# Altium project foxbms2-master.PrjPcb (part 6 of 8)

## Sheet sbc-base.SchDoc
size A3; DocumentNumber: 44; SheetNumber: 44; SheetTotal: 45; SheetDescription: System basic chip for MCU
Used 2 times, as channels supply/sbcs/sbc-mcu, supply/sbcs/sbc-per. Parts and nets are listed once, with the designators drawn on the sheet.
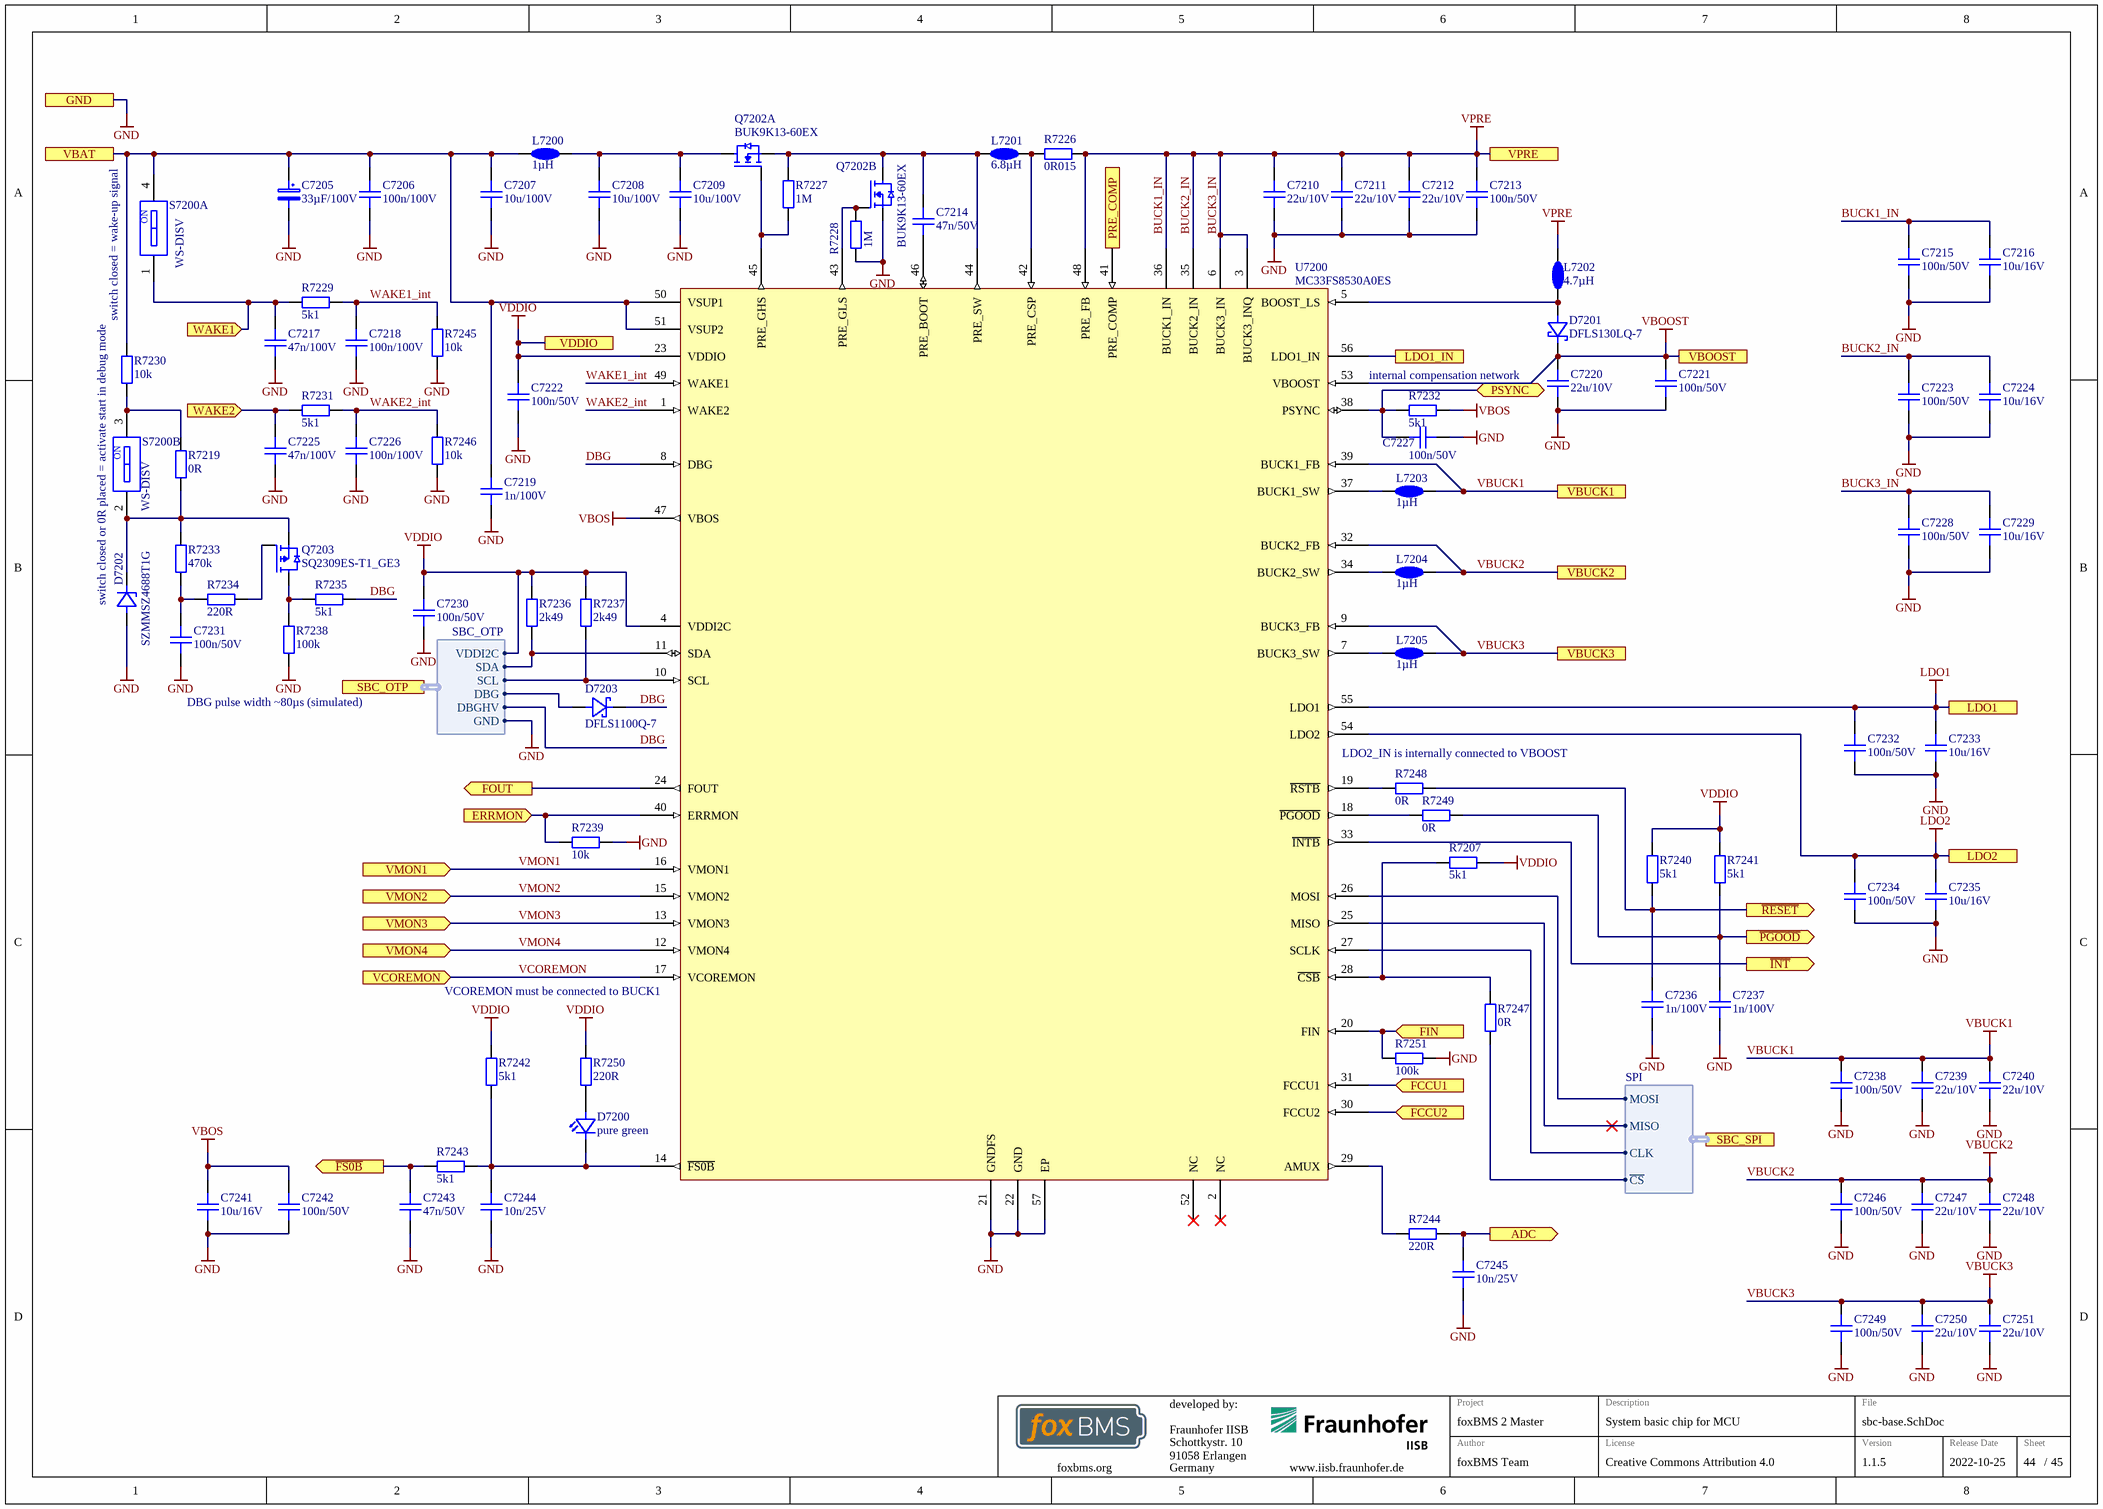
[diagram p41: sbc-base.SchDoc]

### Parts
C7205  33µF/100V  [ELECTROLYTIC_CAP_PANASONIC_G]
C7206  100n/100V  [CAPC1608X08N]
C7207  10u/100V  [CAPC5750X28N]
C7208  10u/100V  [CAPC5750X28N]
C7209  10u/100V  [CAPC5750X28N]
C7210  22u/10V  [CAPC3216X18N]
C7211  22u/10V  [CAPC3216X18N]
C7212  22u/10V  [CAPC3216X18N]
C7213  100n/50V  [CAPC1005X06N]
C7214  47n/50V  [CAPC1005X06N]
C7215  100n/50V  [CAPC1005X06N]
C7216  10u/16V  [CAPC2012X14N]
C7217  47n/100V  [CAPC1608X08N]
C7218  100n/100V  [CAPC1608X08N]
C7219  1n/100V  [CAPC1005X06N]
C7220  22u/10V  [CAPC3216X18N]
C7221  100n/50V  [CAPC1005X06N]
C7222  100n/50V  [CAPC1005X06N]
C7223  100n/50V  [CAPC1005X06N]
C7224  10u/16V  [CAPC2012X14N]
C7225  47n/100V  [CAPC1608X08N]
C7226  100n/100V  [CAPC1608X08N]
C7227  100n/50V  [CAPC1005X06N]
C7228  100n/50V  [CAPC1005X06N]
C7229  10u/16V  [CAPC2012X14N]
C7230  100n/50V  [CAPC1005X06N]
C7231  100n/50V  [CAPC1005X06N]
C7232  100n/50V  [CAPC1005X06N]
C7233  10u/16V  [CAPC2012X14N]
C7234  100n/50V  [CAPC1005X06N]
C7235  10u/16V  [CAPC2012X14N]
C7236  1n/100V  [CAPC1005X06N]
C7237  1n/100V  [CAPC1005X06N]
C7238  100n/50V  [CAPC1005X06N]
C7239  22u/10V  [CAPC3216X18N]
C7240  22u/10V  [CAPC3216X18N]
C7241  10u/16V  [CAPC2012X14N]
C7242  100n/50V  [CAPC1005X06N]
C7243  47n/50V  [CAPC1005X06N]
C7244  10n/25V  [CAPC1005X06N]
C7245  10n/25V  [CAPC1005X06N]
C7246  100n/50V  [CAPC1005X06N]
C7247  22u/10V  [CAPC3216X18N]
C7248  22u/10V  [CAPC3216X18N]
C7249  100n/50V  [CAPC1005X06N]
C7250  22u/10V  [CAPC3216X18N]
C7251  22u/10V  [CAPC3216X18N]
D7200  pure green  [LEDC1608X07N]
D7201  DFLS130LQ-7  [PowerDI123]
D7202  SZMMSZ4688T1G  [SOD-123_CASE-425-04-ISSUE-G]
D7203  DFLS1100Q-7  [PowerDI123]
L7200  1µH  [ASPIAIG-S4035]
L7201  6.8µH  [PA4342.XXXNLT_Footprint_2]
L7202  4.7µH  [ASPIAIG-S4035]
L7203  1µH  [TDK_TFM252012]
L7204  1µH  [TDK_TFM252012]
L7205  1µH  [TDK_TFM252012]
Q7202  BUK9K13-60EX  [NXP-SOT1205_N]  (parts A,B of 2)
Q7203  SQ2309ES-T1_GE3  [SOT95P237X110-3N]
R7207  5k1  [RESC1005X04N]
R7219  0R  [RESC1005X04N]
R7226  0R015  [PANASONIC_ERJ-B1]
R7227  1M  [RESC1005X04N]
R7228  1M  [RESC1005X04N]
R7229  5k1  [RESC1005X04N]
R7230  10k  [RESC1005X04N]
R7231  5k1  [RESC1005X04N]
R7232  5k1  [RESC1005X04N]
R7233  470k  [RESC1005X04N]
R7234  220R  [RESC1005X04N]
R7235  5k1  [RESC1005X04N]
R7236  2k49  [RESC1005X04N]
R7237  2k49  [RESC1005X04N]
R7238  100k  [RESC1005X04N]
R7239  10k  [RESC1005X04N]
R7240  5k1  [RESC1005X04N]
R7241  5k1  [RESC1005X04N]
R7242  5k1  [RESC1005X04N]
R7243  5k1  [RESC1005X04N]
R7244  220R  [RESC1005X04N]
R7245  10k  [RESC1005X04N]
R7246  10k  [RESC1005X04N]
R7247  0R  [RESC1005X04N]
R7248  0R  [RESC1005X04N]
R7249  0R  [RESC1005X04N]
R7250  220R  [RESC1005X04N]
R7251  100k  [RESC1005X04N]
S7200  WS-DISV  [WE_416131160802]  (parts A,B of 2)
U7200  MC33FS8530A0ES  [MC33FS8530A0ES]

### Ports
ADC (out), ERRMON (in), FCCU1 (in), FCCU2 (in), FIN (in), FOUT (out), GND, LDO1, LDO1_IN, LDO2, PRE_COMP (in), PSYNC (bidir), SBC_OTP (harness SBC_OTP), SBC_SPI (harness SPI), VBAT, VBOOST, VBUCK1, VBUCK2, VBUCK3, VCOREMON (in), VDDIO, VMON1 (in), VMON2 (in), VMON3 (in), VMON4 (in), VPRE, WAKE1 (in), WAKE2 (in), ~{FS0B} (out), ~{INT} (out), ~{PGOOD} (out), ~{RESET} (out)

### Harnesses
SBC_OTP: VDDI2C, SDA, SCL, GND, DBG, DBGHV
SPI: CLK, MOSI, MISO, ~{CS}

### Nets
GND: C7205.2 C7206.1 C7207.1 C7208.1 C7209.1 C7210.1 C7211.1 C7212.1 C7213.1 C7215.1 C7216.1 C7217.1 C7218.1 C7219.1 C7220.1 C7221.1 C7222.1 C7223.1 C7224.1 C7225.1 C7226.1 C7227.1 C7228.1 C7229.1 C7230.1 C7231.1 C7232.1 C7233.1 C7234.1 C7235.1 C7236.1 C7237.1 C7238.1 C7239.1 C7240.1 C7241.1 C7242.1 C7243.1 C7244.1 C7245.1 C7246.1 C7247.1 C7248.1 C7249.1 C7250.1 C7251.1 D7202.2(A) Q7202.3(S) R7228.1 R7238.1 R7239.1 R7245.2 R7246.2 R7251.2 U7200.21(GNDFS) U7200.22(GND) U7200.57(EP) ; port GND, port SBC_OTP.GND
LDO1: C7232.2 C7233.2 U7200.55(LDO1) ; port LDO1
LDO2: C7234.2 C7235.2 U7200.54(LDO2) ; port LDO2
VBOOST: C7220.2 C7221.2 D7201.1(K) U7200.53(VBOOST) ; port VBOOST
VBOS: C7241.2 C7242.2 R7232.2 U7200.47(VBOS)
VBUCK1: C7238.2 C7239.2 C7240.2 L7203.2 U7200.39(BUCK1_FB) ; port VBUCK1
VBUCK2: C7246.2 C7247.2 C7248.2 L7204.2 U7200.32(BUCK2_FB) ; port VBUCK2
VBUCK3: C7249.2 C7250.2 C7251.2 L7205.2 U7200.9(BUCK3_FB) ; port VBUCK3
VDDIO: C7222.2 C7230.2 R7207.1 R7236.2 R7237.2 R7240.2 R7241.2 R7242.2 R7250.2 U7200.4(VDDI2C) U7200.23(VDDIO) ; port VDDIO, port SBC_OTP.VDDI2C
VPRE: C7210.2 C7211.2 C7212.2 C7213.2 C7215.2 C7216.2 C7223.2 C7224.2 C7228.2 C7229.2 L7202.2 R7226.2 U7200.3(BUCK3_INQ) U7200.6(BUCK3_IN) U7200.35(BUCK2_IN) U7200.36(BUCK1_IN) U7200.48(PRE_FB) ; port VPRE  [also labelled BUCK1_IN, BUCK2_IN, BUCK3_IN]
~{FS0B}: C7243.2 R7243.2 ; port ~{FS0B}
~{INT}: U7200.33(~{INTB}) ; port ~{INT}
~{PGOOD}: C7237.2 R7241.1 R7249.2 ; port ~{PGOOD}
~{RESET}: C7236.2 R7240.1 R7248.1 ; port ~{RESET}
ADC: C7245.2 R7244.2 ; port ADC
DBG: D7203.1(K) R7235.1 U7200.8(DBG) ; port SBC_OTP.DBGHV
ERRMON: R7239.2 U7200.40(ERRMON) ; port ERRMON
FCCU1: U7200.31(FCCU1) ; port FCCU1
FCCU2: U7200.30(FCCU2) ; port FCCU2
FIN: R7251.1 U7200.20(FIN) ; port FIN
FOUT: U7200.24(FOUT) ; port FOUT
LDO1_IN: U7200.56(LDO1_IN) ; port LDO1_IN
PRE_COMP: U7200.41(PRE_COMP) ; port PRE_COMP
PSYNC: C7227.2 R7232.1 U7200.38(PSYNC) ; port PSYNC
VBAT: C7205.1 C7206.2 C7207.2 C7219.2 L7200.1 R7230.2 S7200.4 U7200.50(VSUP1) U7200.51(VSUP2) ; port VBAT
VCOREMON: U7200.17(VCOREMON) ; port VCOREMON
VMON1: U7200.16(VMON1) ; port VMON1
VMON2: U7200.15(VMON2) ; port VMON2
VMON3: U7200.13(VMON3) ; port VMON3
VMON4: U7200.12(VMON4) ; port VMON4
WAKE1: C7217.2 R7229.2 S7200.1 ; port WAKE1
WAKE1_int: C7218.2 R7229.1 R7245.1 U7200.49(WAKE1)  [project net WAKE1_int_44]
WAKE2: C7225.2 R7231.2 ; port WAKE2
WAKE2_int: C7226.2 R7231.1 R7246.1 U7200.1(WAKE2)  [project net WAKE2_int_44]
NetC7208_2: C7208.2 C7209.2 L7200.2 Q7202.7(D)
NetC7214_1: C7214.1 U7200.46(PRE_BOOT)
NetC7214_2: C7214.2 L7201.1 Q7202.1(S) Q7202.5(D) R7227.2 U7200.44(PRE_SW)
NetC7231_2: C7231.2 R7233.1 R7234.1
NetC7244_2: C7244.2 D7200.1(C) R7242.1 R7243.1 U7200.14(~{FS0B})
NetD7200_2: D7200.2(A) R7250.1
NetD7201_2: D7201.2(A) L7202.1 U7200.5(BOOST_LS)
NetD7202_1: D7202.1(K) Q7203.S R7219.1 R7233.2 S7200.2
NetD7203_2: D7203.2(A) ; port SBC_OTP.DBG
NetL7201_2: L7201.2 R7226.1 U7200.42(PRE_CSP)
NetL7203_1: L7203.1 U7200.37(BUCK1_SW)
NetL7204_1: L7204.1 U7200.34(BUCK2_SW)
NetL7205_1: L7205.1 U7200.7(BUCK3_SW)
NetQ7202_2: Q7202.2(G) R7227.1 U7200.45(PRE_GHS)
NetQ7202_4: Q7202.4(G) R7228.2 U7200.43(PRE_GLS)
NetQ7203_D: Q7203.D R7235.2 R7238.2
NetQ7203_G: Q7203.G R7234.2
NetR7207_2: R7207.2 R7247.2 U7200.28(~{CSB})
NetR7219_2: R7219.2 R7230.1 S7200.3
NetR7236_1: R7236.1 U7200.11(SDA) ; port SBC_OTP.SDA
NetR7237_1: R7237.1 U7200.10(SCL) ; port SBC_OTP.SCL
NetR7244_1: R7244.1 U7200.29(AMUX)
NetR7247_1: R7247.1 ; port SBC_SPI.~{CS}
NetR7248_2: R7248.2 U7200.19(~{RSTB})
NetR7249_1: R7249.1 U7200.18(~{PGOOD})
NetU7200_25: U7200.25(MISO) ; port SBC_SPI.MISO
NetU7200_26: U7200.26(MOSI) ; port SBC_SPI.MOSI
NetU7200_27: U7200.27(SCLK) ; port SBC_SPI.CLK

Not connected (* = marked no-connect by the designer): U7200 2(NC)* 52(NC)*

### Channels
supply/sbcs/sbc-mcu: designators end in _1; ports ADC=SUPPLY_IO.SBC_MCU_ADC ERRMON=NetR7239_1_2 FCCU1=MCU_RST~{.}ERROR FCCU2=MCU_GIOX.T7 FIN=MCU_CLK.2.22MHz FOUT=NetR7251_2_1 GND=GND LDO1=MCU_1.2V_LDO LDO1_IN=MCU_3.3V LDO2=MCU_5.0V_LDO PRE_COMP=NetC7201_1 PSYNC=NetC7227_1_2 VBAT=VSUP_30 VBOOST=MCU_5.74V VBUCK1=MCU_1.2V VBUCK2=MCU_1.1V VBUCK3=MCU_2.5V VCOREMON=VCOREMON VDDIO=MCU_3.3V VMON1=VMON1 VMON2=VMON2 VMON3=VMON3 VMON4=VMON4 VPRE=MCU_3.3V WAKE1=COM_IO.INH WAKE2=PER_IO~{.}RTC_INTA_HV ~{FS0B}=EXT_CON.SBC_MCU_FS0B ~{INT}=MCU_GIOA.0 ~{PGOOD}=EXT_CON~{.}SBC_MCU_PGOOD ~{RESET}=EXT_CON~{.}SBC_MCU_RESET
supply/sbcs/sbc-per: designators end in _2; ports ADC=SUPPLY_IO.SBC_PER_ADC ERRMON=NetR7239_2_2 FCCU1=NetR7211_2 FCCU2=MCU_GIOX.T8 FIN=NetR7251_2_1 FOUT=NetU7200_2_24 GND=GND LDO1=PER_3.3V_LDO LDO1_IN=PER_5.0V LDO2=PER_5.0V_LDO PRE_COMP=NetC7203_1 PSYNC=NetC7227_2_2 VBAT=VSUP_30 VBOOST=PER_5.74V VBUCK1=PER_1.2V_0 VBUCK2=PER_1.2V_1 VBUCK3=PER_3.3V VCOREMON=VCOREMON VDDIO=PER_3.3V VMON1=VMON1 VMON2=VMON2 VMON3=VMON3 VMON4=VMON4 VPRE=PER_5.0V WAKE1=NetC7217_2_2 WAKE2=WAKE2 ~{FS0B}=EXT_CON.SBC_PER_FS0B ~{INT}=MCU_GIOA.1 ~{PGOOD}=EXT_CON~{.}SBC_PER_PGOOD ~{RESET}=EXT_CON~{.}SBC_PER_RESET

### Notes on the sheet
- (near R7230) switch closed = wake-up signal
- (near C7220) internal compensation network
- switch closed or 0R placed = activate start in debug mode
- DBG pulse width ~80µs (simulated)
- (near U7200) LDO2_IN is internally connected to VBOOST
- (near U7200) VCOREMON must be connected to BUCK1
- Fraunhofer IISB
- Schottkystr. 10
- developed by:
- 91058 Erlangen
- Germany
- Author
- Project
- License
- Description
- File
- Version
- Release Date
- Sheet
- foxbms.org <https://foxbms.org>
- www.iisb.fraunhofer.de <https://www.iisb.fraunhofer.de/>
- foxBMS Team
- /
- (in symbol WE_416131160802, part A) ON
- (in symbol WE_416131160802, part B) ON

### Library data of the parts
C7205 = EEE-TG2A330P: SMD Electrolytic Capacitor; Capacitance: 33µF; Rated Voltage: 100V; Tolerance: +-20%; Heigth: 10.5mm; Automotive Qualified: True; Part Number: EEE-TG2A330P; Operating Temperature: -40°C to 125°C; Diameter: 10mm; ComponentLink1Description: Datasheet; ComponentLink1URL: https://industrial.panasonic.com/cdbs/www-data/pdf/RDE0000/ABA0000C1187.pdf; Supplier 1: Digikey; Supplier Part Number 1: PCE4126CT-ND
C7206 C7218 C7226 = gen_C_ceramic_100n_100V_X7R_0603: MLCC; Capacitance: 100n; Rated Voltage: 100V; Dielectric: X7R; Case EIA: 0603; Case Metric: 1608; Automotive Qualified: True; PnP Package: 0603C; Part Number: gen_C_ceramic_100n_100V_X7R_0603; Supplier 1: Digikey; Supplier Part Number 1: 490-13420-1-ND; Supplier 2: Mouser; Supplier Part Number 2: 81-GCJ188R72A104KA1D
C7207-C7209 = gen_C_ceramic_10u_100V_X7S_2220: as C7105-C7108 on sheet buck-boost-converter; Part Number: gen_C_ceramic_10u_100V_X7S_2220; Supplier 1: Digikey; Supplier Part Number 1: 445-13152-1-ND; ECCN: EAR99
C7210-C7212 C7220 C7239 C7240 C7247 C7248 C7250 C7251 = gen_C_ceramic_22u_10V_X7R_1206: MLCC; Capacitance: 22u; Rated Voltage: 10V; Dielectric: X7R; Case EIA: 1206; Case Metric: 3216; Automotive Qualified: True; Part Number: gen_C_ceramic_22u_10V_X7R_1206; Supplier 1: Digikey; Supplier Part Number 1: 587-4243-1-ND
C7213 C7215 C7221-C7223 C7227 C7228 C7230-C7232 C7234 C7238 C7242 C7246 C7249 = gen_C_ceramic_100n_50V_X7R_0402: MLCC; Capacitance: 100n; Rated Voltage: 50V; Dielectric: X7R; Case EIA: 0402; Case Metric: 1005; PnP Package: 0402C; PnP Value: 100nF/50V/X7R; PnP equipped: x; Automotive Qualified: True; AEC-Q Norm: AEC-Q200; Part Number: gen_C_ceramic_100n_50V_X7R_0402; Supplier 1: Farnell; Supplier Part Number 1: 2210822; ECCN: EAR99
C7214 C7243 = gen_C_ceramic_47n_50V_X7R_0402: MLCC; Capacitance: 47n; Rated Voltage: 50V; Dielectric: X7R; Case EIA: 0402; Case Metric: 1005; Automotive Qualified: True; PnP Package: 0402C; Part Number: gen_C_ceramic_47n_50V_X7R_0402; Supplier 1: Farnell; Supplier Part Number 1: 2210827
C7216 C7224 C7229 C7233 C7235 C7241 = gen_C_ceramic_10u_16V_X7R_0805: MLCC; Capacitance: 10u; Rated Voltage: 16V; Dielectric: X7S; Case EIA: 0805; Case Metric: 2012; Automotive Qualified: True; AEC-Q Grade: Grade 1; AEC-Q Norm: AEC-Q200; Part Number: gen_C_ceramic_10u_16V_X7R_0805; ECCN: EAR99; Supplier 1: Digikey; Supplier Part Number 1: 445-16110-1-ND
C7217 C7225 = gen_C_ceramic_47n_100V_X7R_0603: MLCC; Capacitance: 47n; Rated Voltage: 100V; Dielectric: X7R; Case EIA: 0603; Case Metric: 1608; Automotive Qualified: True; PnP Package: 0603C; Part Number: gen_C_ceramic_47n_100V_X7R_0603; Supplier 1: Farnell; Supplier Part Number 1: 2478249; Supplier 2: Farnell; Supplier Part Number 2: 2708699; Supplier 3: Farnell; Supplier Part Number 3: 2905110
C7219 C7236 C7237 = gen_C_ceramic_1n_100V_X7R_0402: MLCC; Capacitance: 1n; Rated Voltage: 100V; Dielectric: X7R; Case EIA: 0402; Case Metric: 1005; Automotive Qualified: True; PnP Package: 0402C; Part Number: gen_C_ceramic_1n_100V_X7R_0402; Supplier 1: Digikey; Supplier Part Number 1: 490-4764-1-ND
C7244 C7245 = gen_C_ceramic_10n_25V_X7R_0402: MLCC; Capacitance: 10n; Rated Voltage: 25V; Dielectric: X7R; Case EIA: 0402; Case Metric: 1005; PnP Package: 0402C; PnP Value: 10nF/25V/X7R; PnP equipped: x; Automotive Qualified: True; Part Number: gen_C_ceramic_10n_25V_X7R_0402; Supplier 1: Farnell; Supplier Part Number 1: 2210793
D7200 = LED_0603_pure_green_AECQ: as D7000-D7003 on sheet supply; Part Number: LED_0603_pure_green_AECQ; Color: pure green; Operating Temperature: -40°C - 100°C; ComponentLink1Description: Datasheet; ComponentLink1URL: http://www.farnell.com/datasheets/2049164.pdf; Supplier 1: Farnell; Supplier Part Number 1: 1328306; Supplier 2: Digikey; Supplier Part Number 2: 751-1176-1-ND; PnP Package: LED_0603
D7201 = DFLS130LQ-7: Schottky Diode; Manufacturer: Diodes Inc.; Breakdown Voltage: 30V; Continuous Forward Current: 1A; Automotive Qualified: True; Part Number: DFLS130LQ-7; Part Name: DFLS130LQ-7; Operating Temperature: −40°C - +125°C; ComponentLink1Description: Datasheet; ComponentLink1URL: https://www.diodes.com/assets/Datasheets/DFLS130LQ.pdf; Supplier 1: Digikey; Supplier Part Number 1: DFLS130LQ-7DICT-ND
D7202 = SZMMSZ4688T1G: Zener Diode; Manufacturer: ON Semiconductor; Breakdown Voltage: 4.7V; PnP Package: SOD123; Automotive Qualified: True; Part Number: SZMMSZ4688T1G; Part Name: SZMMSZ4688T1G; Operating Temperature: -55°C - +150°C; ComponentLink1Description: Datasheet; ComponentLink1URL: https://www.onsemi.com/pub/Collateral/MMSZ4678T1-D.PDF; Supplier 1: Digikey; Supplier Part Number 1: SZMMSZ4688T1GOSCT-ND; Supplier 2: Farnell; Supplier Part Number 2: 2774579; Supplier 3: Mouser; Supplier Part Number 3: 863-SZMMSZ4688T1G
D7203 = DFLS1100Q-7: Schottky Diode; Manufacturer: Diodes Inc.; Breakdown Voltage: 100V; Continuous Forward Current: 1A; Automotive Qualified: True; Part Number: DFLS1100Q-7; Part Name: DFLS1100Q-7; Operating Temperature: −55°C - +175°C; ComponentLink1Description: Datasheet; ComponentLink1URL: https://www.diodes.com/assets/Datasheets/ds30497.pdf; Supplier 1: Mouser; Supplier Part Number 1: 621-DFLS1-100Q-7; Supplier 2: Digikey; Supplier Part Number 2: DFLS1100Q-7DICT-ND; Supplier 3: Farnell; Supplier Part Number 3: 3127293; PnP Package: POWERDI123
L7200 = ASPIAIG-S4035-1R0M-T: Power Inductor; Manufacturer: Abracon LLC; Rated Current: 4.5A; Saturation Current: 6.9A; Automotive Qualified: True; Part Number: ASPIAIG-S4035-1R0M-T; Operating Temperature: –40°C - +125°C; ComponentLink1Description: Datasheet; ComponentLink1URL: https://abracon.com/Magnetics/power/ASPIAIG-S4035.pdf; Inductance: 1µH; Supplier 1: Digikey; Supplier Part Number 1: 535-14223-1-ND; Supplier 2: Farnell; Supplier Part Number 2: 2848347
L7201 = PA4342.682NLT: Power Inductor; Manufacturer: Pulse; Rated Current: 8.5A; Saturation Current: 13.5A; Automotive Qualified: True; Part Number: PA4342.682NLT; Operating Temperature: -40°C - +125°C; ComponentLink1Description: Datasheet; ComponentLink1URL: https://www.mouser.de/datasheet/2/336/P769-1526786.pdf; Inductance: 6.8µH; Supplier 1: Digikey; Supplier Part Number 1: 553-3442-1-ND; Supplier 2: Mouser; Supplier Part Number 2: 673-PA4342.682NLT
L7202 = ASPIAIG-S4035-4R7M-T: Power Inductor; Manufacturer: Abracon LLC; Rated Current: 2.45A; Saturation Current: 3.2A; Automotive Qualified: True; Part Number: ASPIAIG-S4035-4R7M-T; Operating Temperature: –40°C - +125°C; ComponentLink1Description: Datasheet; ComponentLink1URL: https://abracon.com/Magnetics/power/ASPIAIG-S4035.pdf; Inductance: 4.7µH; Supplier 1: Digikey; Supplier Part Number 1: 535-14227-1-ND
L7203-L7205 = TFM252012ALMA1R0MTAA: Power Inductor; Manufacturer: TDK; Rated Current: 3.7A; Saturation Current: 4.2A; Automotive Qualified: True; Part Number: TFM252012ALMA1R0MTAA; Operating Temperature: –55°C - +150°C; ComponentLink1Description: Datasheet; ComponentLink1URL: https://product.tdk.com/info/en/catalog/datasheets/inductor_automotive_power_tfm252012alma_en.pdf; Inductance: 1µH; Supplier 1: Digikey; Supplier Part Number 1: 445-175183-1-ND
Q7202 = BUK9K13-60EX: Dual N-channel 60 V, 12.5 mΩ logic level MOSFET; Manufacturer: Nexperia; Maximum Drain-Source Voltage: 60V; Maximum Continous Drain Current (25°C): 40A; R_DS(on): 12.5m; Total Gate Charge: 7.9nC; Automotive Qualified: True; AEC-Q Norm: AEC-Q101; AEC-Q Grade: Grade 0; Part Number: BUK9K13-60EX; Part Name: BUK9K13-60EX; Operating Temperature: -55°C - +170°C; ComponentLink1Description: Datasheet; ComponentLink1URL: https://4donline.ihs.com/images/VipMasterIC/IC/NEXP/NEXP-S-A0003105620/NEXP-S-A0003105797-1.pdf?hkey=6D3A4C79FDBF58556ACFDE234799DDF0; Supplier 1: Digikey; Supplier Part Number 1: 1727-2467-1-ND; Supplier 2: Mouser; Supplier Part Number 2: 771-BUK9K13-60EX; Supplier 3: Farnell; Supplier Part Number 3: 3439704; ECCN: EAR99
Q7203 = SQ2309ES-T1_GE3: MOSFET-Transistor, p-channel, -1.7 A, -60 V; Manufacturer: Vishay; Maximum Drain-Source Voltage: 60V; Maximum Continous Drain Current (25°C): 1.7A; R_DS(on): 336m; Total Gate Charge: 8.5nC; Automotive Qualified: True; Part Number: SQ2309ES-T1_GE3; Part Name: PMOS; Operating Temperature: -55°C - +175°C; ComponentLink1Description: Datasheet; ComponentLink1URL: http://www.vishay.com/docs/67024/sq2309es.pdf; Supplier 1: Digikey; Supplier Part Number 1: SQ2309ES-T1_GE3CT-ND; Supplier 2: Farnell; Supplier Part Number 2: 2617108; Supplier 3: Mouser; Supplier Part Number 3: 781-SQ2309ES-T1_GE3
R7207 R7229 R7231 R7232 R7235 R7240-R7243 = gen_R_5k1_0402: SMD Resistor 5k1 0402; Tolerance: 1%; Power: 0.063W; Case EIA: 0402; Case Metric: 1005; Maximum Working Voltage: 50V; PnP Package: 0402R; PnP equipped: x; Automotive Qualified: True; AEC-Q Grade: Grade 0; AEC-Q Norm: AEC-Q200; Part Number: gen_R_5k1_0402; Operating Temperature: -55°C - +155°C; Resistance: 5k1; Series: E24; PnP Value: 5k1; ECCN: EAR99; Supplier 1: Farnell; Supplier Part Number 1: 2302709
R7219 R7247-R7249 = gen_R_0R_0402: SMD Resistor 0R 0402; Power: 0.063W; Case EIA: 0402; Case Metric: 1005; Maximum Working Voltage: 50V; PnP Package: 0402R; Automotive Qualified: True; AEC-Q Norm: AEC-Q200; PnP equipped: x; Part Number: gen_R_0R_0402; Operating Temperature: -55°C - +155°C; Resistance: 0R; Series: Jumper; PnP Value: 0R; Supplier 1: Farnell; Supplier Part Number 1: 1469661; Supplier 2: Farnell; Supplier Part Number 2: 2059190; ECCN: EAR99
R7226 = ERJ-B1CFR015U: SMD Shunt Resistor 0R015; Tolerance: 1%; Power: 2W; Case EIA: ERJ-B1; Maximum Working Voltage: 200V; Automotive Qualified: True; Part Number: ERJ-B1CFR015U; Operating Temperature: -55°C - +155°C; Resistance: 0R015; Supplier 1: Farnell; Supplier Part Number 1: 2294050; Supplier 2: Mouser; Supplier Part Number 2: 667-ERJ-B1CFR015U
R7227 R7228 = gen_R_1M_0402: SMD Resistor 1M 0402; Tolerance: 1%; Power: 0.063W; Case EIA: 0402; Case Metric: 1005; Maximum Working Voltage: 50V; PnP Package: 0402R; Automotive Qualified: True; AEC-Q Grade: Grade 0; AEC-Q Norm: AEC-Q200; Part Number: gen_R_1M_0402; Operating Temperature: -55°C - +155°C; Resistance: 1M; Series: E24, E96; PnP Value: 1M; ECCN: EAR99; Supplier 1: Digikey; Supplier Part Number 1: A129663CT-ND
R7230 R7245 R7246 = gen_R_10k_0402: SMD Resistor 10k 0402; Tolerance: 1%; Power: 0.063W; Case EIA: 0402; Case Metric: 1005; Maximum Working Voltage: 50V; PnP Package: 0402R; PnP equipped: x; Automotive Qualified: True; AEC-Q Norm: AEC-Q200; Part Number: gen_R_10k_0402; Operating Temperature: -55°C - +155°C; Resistance: 10k; Series: E24, E96; PnP Value: 10k; Supplier 1: Farnell; Supplier Part Number 1: 2059239; ECCN: EAR99
R7233 = gen_R_470k_0402: SMD Resistor 470k 0402; Tolerance: 1%; Power: 0.063W; Case EIA: 0402; Case Metric: 1005; Maximum Working Voltage: 50V; PnP Package: 0402R; Automotive Qualified: True; Part Number: gen_R_470k_0402; Operating Temperature: -55°C - +155°C; Resistance: 470k; Series: E24; PnP Value: 470k; Supplier 1: Farnell; Supplier Part Number 1: 2302916
R7234 R7244 = gen_R_220R_0402: SMD Resistor 220R 0402; Tolerance: 1%; Power: 0.063W; Case EIA: 0402; Case Metric: 1005; Maximum Working Voltage: 50V; PnP Package: 0402R; Automotive Qualified: True; AEC-Q Grade: Grade 0; AEC-Q Norm: AEC-Q200; Part Number: gen_R_220R_0402; Operating Temperature: -55°C - +155°C; Resistance: 220R; Series: E24; PnP Value: 220R; ECCN: EAR99; Supplier 1: Digikey; Supplier Part Number 1: A129619CT-ND
R7236 R7237 = gen_R_2k49_0402: SMD Resistor 2k49 0402; Tolerance: 1%; Power: 0.063W; Case EIA: 0402; Case Metric: 1005; Maximum Working Voltage: 50V; PnP Package: 0402R; Automotive Qualified: True; Part Number: gen_R_2k49_0402; Operating Temperature: -55°C - +155°C; Resistance: 2k49; Series: E96; PnP Value: 2k49; Supplier 1: Farnell; Supplier Part Number 1: 2059135
R7238 R7251 = gen_R_100k_0402: SMD Resistor 100k 0402; Tolerance: 1%; Power: 0.063W; Case EIA: 0402; Case Metric: 1005; Maximum Working Voltage: 50V; PnP Package: 0402R; PnP equipped: x; Automotive Qualified: True; Part Number: gen_R_100k_0402; Operating Temperature: -55°C - +155°C; Resistance: 100k; Series: E24, E96; PnP Value: 100k; Supplier 1: Farnell; Supplier Part Number 1: 2302839
R7239 = gen_R_10k_0402: SMD Resistor 10k 0402; Tolerance: 1%; Power: 0.063W; Case EIA: 0402; Case Metric: 1005; Maximum Working Voltage: 50V; PnP Package: 0402R; Automotive Qualified: True; PnP equipped: x; AEC-Q Norm: AEC-Q200; Part Number: gen_R_10k_0402; Operating Temperature: -55°C - +155°C; Resistance: 10k; Series: E24, E96; PnP Value: 10k; Supplier 1: Farnell; Supplier Part Number 1: 2059239; ECCN: EAR99
R7250 = gen_R_220R_0402: SMD Resistor 220R 0402; Tolerance: 1%; Power: 0.063W; Case EIA: 0402; Case Metric: 1005; Maximum Working Voltage: 50V; PnP Package: 0402R; Automotive Qualified: True; AEC-Q Norm: AEC-Q200; AEC-Q Grade: Grade 0; Part Number: gen_R_220R_0402; Operating Temperature: -55°C - +155°C; Resistance: 220R; Series: E24; PnP Value: 220R; Supplier 1: Digikey; Supplier Part Number 1: A129619CT-ND; ECCN: EAR99
S7200 = WE_416131160802: WS-DISV Small Compact SMT DipSwitch; Manufacturer: Würth Elektronik; Automotive Qualified: False; Part Number: WE_416131160802; Part Name: WS-DISV; Operating Temperature: -40°C - +85°C; ComponentLink1Description: Datasheet; ComponentLink1URL: https://www.we-online.de/katalog/datasheet/418121270802.pdf; Supplier 1: Digikey; Supplier Part Number 1: 732-3852-1-ND; Supplier 2: Mouser; Supplier Part Number 2: 710-416131160802
U7200 = MC33FS8530A0ES: Fail-safe system basis chip with multiple SMPS and LDO; Manufacturer: NXP; PnP Package: HPQFN-56; Automotive Qualified: True; AEC-Q Norm: AEC-Q100; AEC-Q Grade: Grade 1; Part Number: MC33FS8530A0ES; Part Name: MC33FS8530A0ES; Operating Temperature: −40°C - +125°C; Supplier 1: Mouser; Supplier Part Number 1: 771-MC33FS8530A0ES; Supplier 2: Digikey; Supplier Part Number 2: 568-MC33FS8530A0ES-ND; ECCN: EAR99

## Sheet io-matrix.SchDoc
size A3; DocumentNumber: 21; SheetNumber: 21; SheetTotal: 45; SheetDescription: IO Connection Matrix
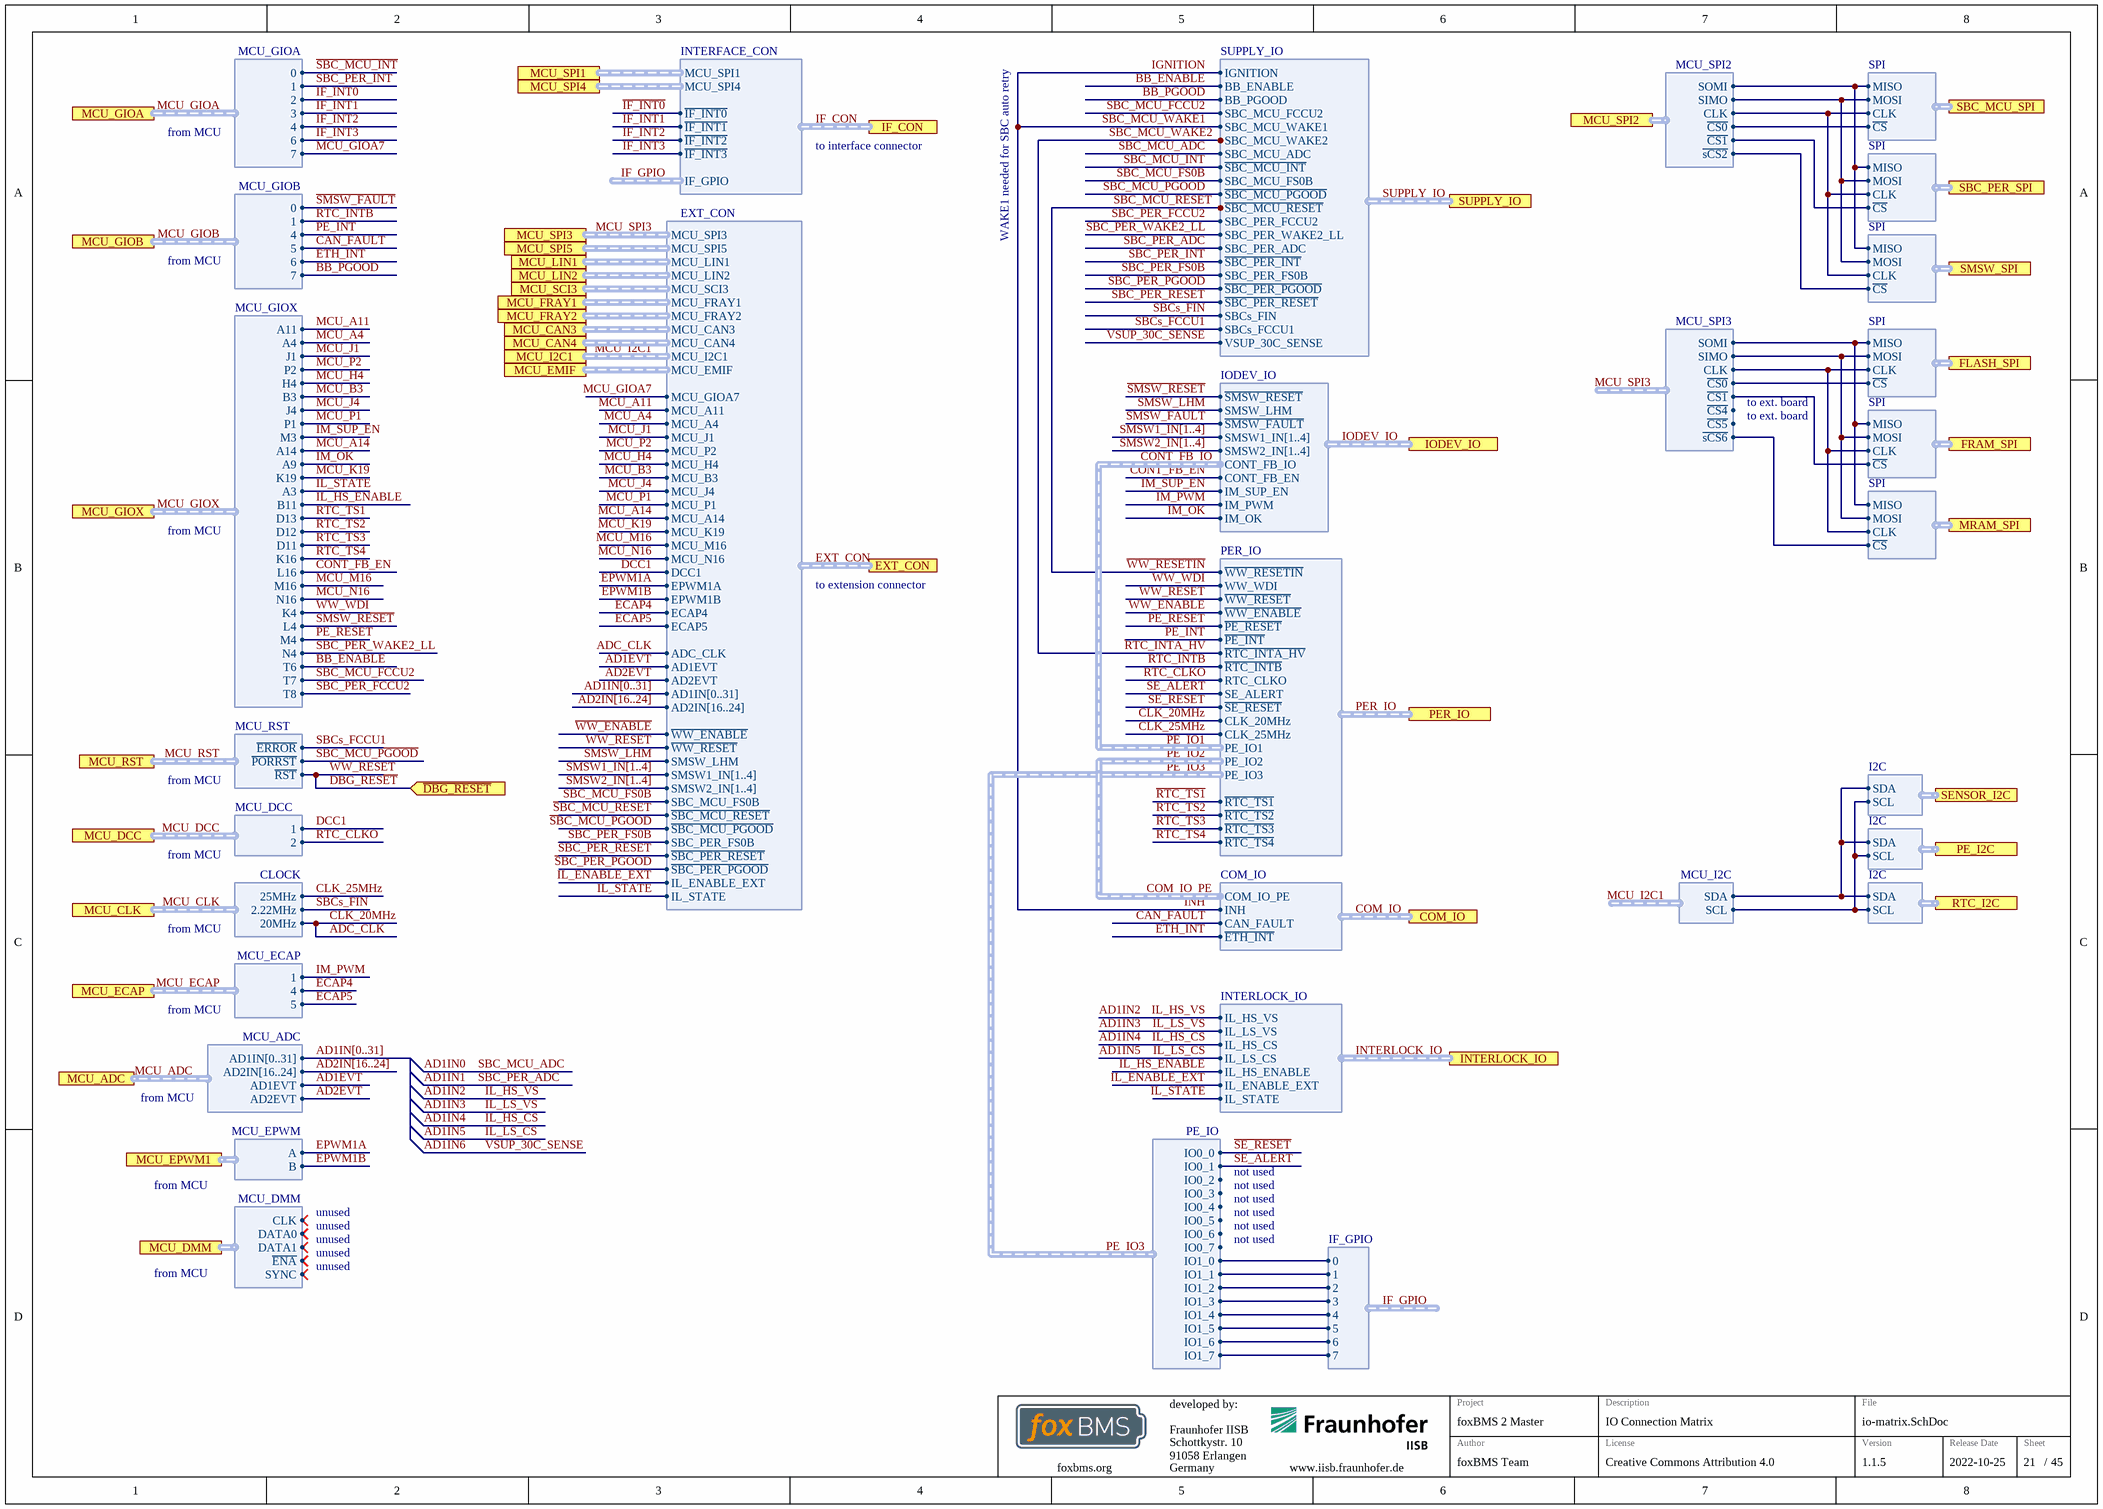
[diagram p42: io-matrix.SchDoc]

### Ports
COM_IO (harness COM_IO), EXT_CON (harness EXT_CON), FLASH_SPI (harness SPI), FRAM_SPI (harness SPI), IF_CON (harness INTERFACE_CON), INTERLOCK_IO (harness INTERLOCK_IO), IODEV_IO (harness IODEV_IO), MCU_ADC (harness MCU_ADC), MCU_CAN3 (harness MCU_CAN), MCU_CAN4 (harness MCU_CAN), MCU_CLK (harness CLOCK), MCU_DCC (harness MCU_DCC), MCU_DMM (harness MCU_DMM), MCU_ECAP (harness MCU_ECAP), MCU_EMIF (harness MCU_EMIF), MCU_EPWM1 (harness MCU_EPWM), MCU_FRAY1 (harness MCU_FRAY), MCU_FRAY2 (harness MCU_FRAY), MCU_GIOA (harness MCU_GIOA), MCU_GIOB (harness MCU_GIOB), MCU_GIOX (harness MCU_GIOX), MCU_I2C1 (harness MCU_I2C), MCU_LIN1 (harness MCU_LIN), MCU_LIN2 (harness MCU_LIN), MCU_RST (harness MCU_RST), MCU_SCI3 (harness MCU_SCI), MCU_SPI1 (harness MCU_SPI1), MCU_SPI2 (harness MCU_SPI2), MCU_SPI3 (harness MCU_SPI3), MCU_SPI4 (harness MCU_SPI4), MCU_SPI5 (harness MCU_SPI5), MRAM_SPI (harness SPI), PE_I2C (harness I2C), PER_IO (harness PER_IO), RTC_I2C (harness I2C), SBC_MCU_SPI (harness SPI), SBC_PER_SPI (harness SPI), SENSOR_I2C (harness I2C), SMSW_SPI (harness SPI), SUPPLY_IO (harness SUPPLY_IO), ~{DBG_RESET} (in)

### Harnesses
MCU_GIOX: A11, A4, J1, P2, H4, B3, J4, P1, M3, A14, A9, K19, A3, B11, D13, D12, D11, K16, L16, M16, N16, K4, L4, M4, N4, T6, T7, T8
MCU_SPI2: CLK, SIMO, SOMI, ~{CS1}, ~{CS0}, ~{sCS2}
MCU_SPI3: CLK, SIMO, SOMI, ~{CS1}, ~{CS4}, ~{CS5}, ~{CS0}, ~{sCS6}
SPI: CLK, MOSI, MISO, ~{CS}
MCU_I2C: SDA, SCL
I2C: SDA, SCL
MCU_GIOA: 0, 1, 2, 3, 4, 6, 7
MCU_RST: ~{ERROR}, ~{PORRST}, ~{RST}
MCU_DCC: 1, 2
MCU_GIOB: 0, 1, 4, 5, 6, 7
CLOCK: 2.22MHz, 20MHz, 25MHz
PE_IO: IO0_0, IO0_1, IO0_2, IO0_3, IO0_4, IO0_5, IO0_6, IO0_7, IO1_0, IO1_1, IO1_2, IO1_3, IO1_4, IO1_5, IO1_6, IO1_7
MCU_ECAP: 1, 4, 5
IODEV_IO: ~{SMSW_RESET}, SMSW_LHM, ~{SMSW_FAULT}, CONT_FB_IO, CONT_FB_EN, IM_SUP_EN, IM_PWM, IM_OK, SMSW1_IN[1..4], SMSW2_IN[1..4]
MCU_ADC: AD2IN[16..24], AD1EVT, AD2EVT, AD1IN[0..31]
SUPPLY_IO: IGNITION, BB_ENABLE, BB_PGOOD, SBC_MCU_FCCU2, SBC_MCU_WAKE1, SBC_MCU_WAKE2, SBC_MCU_ADC, ~{SBC_MCU_INT}, SBC_MCU_FS0B, ~{SBC_MCU_PGOOD}, ~{SBC_MCU_RESET}, SBC_PER_FCCU2, SBC_PER_WAKE2_LL, SBC_PER_ADC, ~{SBC_PER_INT}, SBC_PER_FS0B, SBCs_FIN, SBCs_FCCU1, ~{SBC_PER_PGOOD}, ~{SBC_PER_RESET}, VSUP_30C_SENSE
COM_IO: COM_IO_PE, CAN_FAULT, ~{ETH_INT}, INH
PER_IO: WW_WDI, ~{WW_RESET}, ~{WW_ENABLE}, ~{PE_RESET}, ~{PE_INT}, ~{RTC_INTA_HV}, ~{RTC_INTB}, RTC_CLKO, SE_ALERT, ~{SE_RESET}, CLK_20MHz, CLK_25MHz, PE_IO1, PE_IO2, PE_IO3, ~{RTC_TS1}, ~{RTC_TS2}, ~{RTC_TS3}, ~{RTC_TS4}, ~{WW_RESETIN}
INTERLOCK_IO: IL_HS_CS, IL_LS_CS, IL_HS_VS, IL_LS_VS, IL_HS_ENABLE, IL_STATE, IL_ENABLE_EXT
EXT_CON: MCU_SPI3, MCU_SPI5, MCU_LIN1, MCU_LIN2, MCU_FRAY1, MCU_FRAY2, MCU_CAN3, MCU_CAN4, MCU_I2C1, MCU_EMIF, DCC1, EPWM1A, EPWM1B, ECAP4, ECAP5, ADC_CLK, AD1EVT, AD2EVT, AD1IN[0..31], AD2IN[16..24], ~{WW_ENABLE}, ~{WW_RESET}, SMSW_LHM, SMSW1_IN[1..4], SMSW2_IN[1..4], SBC_MCU_FS0B, ~{SBC_MCU_RESET}, ~{SBC_MCU_PGOOD}, SBC_PER_FS0B, ~{SBC_PER_RESET}, ~{SBC_PER_PGOOD}, IL_ENABLE_EXT, IL_STATE, MCU_GIOA7, MCU_A11, MCU_A4, MCU_J1, MCU_P2, MCU_H4, MCU_B3, MCU_J4, MCU_P1, MCU_A14, MCU_K19, MCU_M16, MCU_N16, MCU_SCI3
IF_GPIO: 0, 1, 2, 3, 4, 5, 6, 7
MCU_EPWM: A, B
MCU_DMM: CLK, DATA0, DATA1, SYNC, ~{ENA}
INTERFACE_CON: MCU_SPI1, MCU_SPI4, ~{IF_INT0}, ~{IF_INT1}, ~{IF_INT2}, ~{IF_INT3}, IF_GPIO

### Nets
~{DBG_RESET}: port ~{DBG_RESET}, port MCU_RST.~{RST}, port PER_IO.~{WW_RESET}, port EXT_CON.~{WW_RESET}  [also labelled ~{WW_RESET}]
~{ETH_INT}: port MCU_GIOB.6, port COM_IO.~{ETH_INT}  [project net COM_IO~{.}ETH_INT]
~{IF_INT0}: port MCU_GIOA.2, port IF_CON.~{IF_INT0}  [project net IF_CON~{.}IF_INT0]
~{IF_INT1}: port MCU_GIOA.3, port IF_CON.~{IF_INT1}  [project net IF_CON~{.}IF_INT1]
~{IF_INT2}: port MCU_GIOA.4, port IF_CON.~{IF_INT2}  [project net IF_CON~{.}IF_INT2]
~{IF_INT3}: port MCU_GIOA.6, port IF_CON.~{IF_INT3}  [project net IF_CON~{.}IF_INT3]
~{PE_INT}: port MCU_GIOB.4, port PER_IO.~{PE_INT}  [project net MCU_GIOB.4]
~{PE_RESET}: port MCU_GIOX.M4, port PER_IO.~{PE_RESET}  [project net MCU_GIOX.M4]
~{RTC_INTA_HV}: port SUPPLY_IO.SBC_MCU_WAKE2, port PER_IO.~{RTC_INTA_HV}  [also labelled SBC_MCU_WAKE2]  [project net PER_IO~{.}RTC_INTA_HV]
~{RTC_INTB}: port MCU_GIOB.1, port PER_IO.~{RTC_INTB}  [project net MCU_GIOB.1]
~{RTC_TS1}: port MCU_GIOX.D13, port PER_IO.~{RTC_TS1}  [project net MCU_GIOX.D13]
~{RTC_TS2}: port MCU_GIOX.D12, port PER_IO.~{RTC_TS2}  [project net MCU_GIOX.D12]
~{RTC_TS3}: port MCU_GIOX.D11, port PER_IO.~{RTC_TS3}  [project net MCU_GIOX.D11]
~{RTC_TS4}: port MCU_GIOX.K16, port PER_IO.~{RTC_TS4}  [project net MCU_GIOX.K16]
~{SBC_MCU_INT}: port MCU_GIOA.0, port SUPPLY_IO.~{SBC_MCU_INT}  [project net MCU_GIOA.0]
~{SBC_MCU_PGOOD}: port MCU_RST.~{PORRST}, port SUPPLY_IO.~{SBC_MCU_PGOOD}, port EXT_CON.~{SBC_MCU_PGOOD}  [project net EXT_CON~{.}SBC_MCU_PGOOD]
~{SBC_MCU_RESET}: port SUPPLY_IO.~{SBC_MCU_RESET}, port PER_IO.~{WW_RESETIN}, port EXT_CON.~{SBC_MCU_RESET}  [also labelled ~{WW_RESETIN}]  [project net EXT_CON~{.}SBC_MCU_RESET]
~{SBC_PER_INT}: port MCU_GIOA.1, port SUPPLY_IO.~{SBC_PER_INT}  [project net MCU_GIOA.1]
~{SBC_PER_PGOOD}: port SUPPLY_IO.~{SBC_PER_PGOOD}, port EXT_CON.~{SBC_PER_PGOOD}  [project net EXT_CON~{.}SBC_PER_PGOOD]
~{SBC_PER_RESET}: port SUPPLY_IO.~{SBC_PER_RESET}, port EXT_CON.~{SBC_PER_RESET}  [project net EXT_CON~{.}SBC_PER_RESET]
~{SE_RESET}: harness PE_IO.IO0_0, port PER_IO.~{SE_RESET}  [project net PE_IO3.IO0_0]
~{SMSW_FAULT}: port MCU_GIOB.0, port IODEV_IO.~{SMSW_FAULT}  [project net IODEV_IO~{.}SMSW_FAULT]
~{SMSW_RESET}: port MCU_GIOX.L4, port IODEV_IO.~{SMSW_RESET}  [project net IODEV_IO~{.}SMSW_RESET]
~{WW_ENABLE}: port PER_IO.~{WW_ENABLE}, port EXT_CON.~{WW_ENABLE}  [project net EXT_CON~{.}WW_ENABLE]
AD1EVT: port MCU_ADC.AD1EVT, port EXT_CON.AD1EVT  [project net EXT_CON.AD1EVT]
AD2EVT: port MCU_ADC.AD2EVT, port EXT_CON.AD2EVT  [project net EXT_CON.AD2EVT]
ADC_CLK: port MCU_CLK.20MHz, port PER_IO.CLK_20MHz, port EXT_CON.ADC_CLK  [also labelled CLK_20MHz]  [project net EXT_CON.ADC_CLK]
BB_ENABLE: port MCU_GIOX.T6, port SUPPLY_IO.BB_ENABLE  [project net MCU_GIOX.T6]
BB_PGOOD: port MCU_GIOB.7, port SUPPLY_IO.BB_PGOOD  [project net MCU_GIOB.7]
CAN_FAULT: port MCU_GIOB.5, port COM_IO.CAN_FAULT  [project net COM_IO.CAN_FAULT]
CLK_25MHz: port MCU_CLK.25MHz, port PER_IO.CLK_25MHz  [project net MCU_CLK.25MHz]
CONT_FB_EN: port MCU_GIOX.L16, port IODEV_IO.CONT_FB_EN  [project net IODEV_IO.CONT_FB_EN]
DCC1: port MCU_DCC.1, port EXT_CON.DCC1  [project net EXT_CON.DCC1]
ECAP4: port MCU_ECAP.4, port EXT_CON.ECAP4  [project net EXT_CON.ECAP4]
ECAP5: port MCU_ECAP.5, port EXT_CON.ECAP5  [project net EXT_CON.ECAP5]
EPWM1A: port EXT_CON.EPWM1A, port MCU_EPWM1.A  [project net EXT_CON.EPWM1A]
EPWM1B: port EXT_CON.EPWM1B, port MCU_EPWM1.B  [project net EXT_CON.EPWM1B]
FLASH_SPI~{.}CS: port MCU_SPI3.~{CS0}, port FLASH_SPI.~{CS}
FLASH_SPI.CLK: port MCU_SPI3.CLK, port FLASH_SPI.CLK, port FRAM_SPI.CLK, port MRAM_SPI.CLK
FLASH_SPI.MISO: port MCU_SPI3.SOMI, port FLASH_SPI.MISO, port FRAM_SPI.MISO, port MRAM_SPI.MISO
FLASH_SPI.MOSI: port MCU_SPI3.SIMO, port FLASH_SPI.MOSI, port FRAM_SPI.MOSI, port MRAM_SPI.MOSI
FRAM_SPI~{.}CS: port MCU_SPI3.~{CS1}, port FRAM_SPI.~{CS}
IF_GPIO.0: harness PE_IO.IO1_0, harness IF_GPIO.0
IF_GPIO.1: harness PE_IO.IO1_1, harness IF_GPIO.1
IF_GPIO.2: harness PE_IO.IO1_2, harness IF_GPIO.2
IF_GPIO.3: harness PE_IO.IO1_3, harness IF_GPIO.3
IF_GPIO.4: harness PE_IO.IO1_4, harness IF_GPIO.4
IF_GPIO.5: harness PE_IO.IO1_5, harness IF_GPIO.5
IF_GPIO.6: harness PE_IO.IO1_6, harness IF_GPIO.6
IF_GPIO.7: harness PE_IO.IO1_7, harness IF_GPIO.7
IGNITION: port SUPPLY_IO.IGNITION, port SUPPLY_IO.SBC_MCU_WAKE1, port COM_IO.INH  [also labelled INH, SBC_MCU_WAKE1]  [project net COM_IO.INH]
IL_ENABLE_EXT: port INTERLOCK_IO.IL_ENABLE_EXT, port EXT_CON.IL_ENABLE_EXT  [project net EXT_CON.IL_ENABLE_EXT]
IL_HS_ENABLE: port MCU_GIOX.B11, port INTERLOCK_IO.IL_HS_ENABLE  [project net INTERLOCK_IO.IL_HS_ENABLE]
IL_STATE: port MCU_GIOX.A3, port INTERLOCK_IO.IL_STATE, port EXT_CON.IL_STATE  [project net EXT_CON.IL_STATE]
IM_OK: port MCU_GIOX.A9, port IODEV_IO.IM_OK  [project net IODEV_IO.IM_OK]
IM_PWM: port MCU_ECAP.1, port IODEV_IO.IM_PWM  [project net IODEV_IO.IM_PWM]
IM_SUP_EN: port MCU_GIOX.M3, port IODEV_IO.IM_SUP_EN  [project net IODEV_IO.IM_SUP_EN]
MCU_A4: port MCU_GIOX.A4, port EXT_CON.MCU_A4  [project net EXT_CON.MCU_A4]
MCU_A11: port MCU_GIOX.A11, port EXT_CON.MCU_A11  [project net EXT_CON.MCU_A11]
MCU_A14: port MCU_GIOX.A14, port EXT_CON.MCU_A14  [project net EXT_CON.MCU_A14]
MCU_B3: port MCU_GIOX.B3, port EXT_CON.MCU_B3  [project net EXT_CON.MCU_B3]
MCU_GIOA7: port MCU_GIOA.7, port EXT_CON.MCU_GIOA7  [project net EXT_CON.MCU_GIOA7]
MCU_H4: port MCU_GIOX.H4, port EXT_CON.MCU_H4  [project net EXT_CON.MCU_H4]
MCU_I2C1.SCL: port MCU_I2C1.SCL, port RTC_I2C.SCL, port PE_I2C.SCL, port SENSOR_I2C.SCL
MCU_I2C1.SDA: port MCU_I2C1.SDA, port RTC_I2C.SDA, port PE_I2C.SDA, port SENSOR_I2C.SDA
MCU_J1: port MCU_GIOX.J1, port EXT_CON.MCU_J1  [project net EXT_CON.MCU_J1]
MCU_J4: port MCU_GIOX.J4, port EXT_CON.MCU_J4  [project net EXT_CON.MCU_J4]
MCU_K19: port MCU_GIOX.K19, port EXT_CON.MCU_K19  [project net EXT_CON.MCU_K19]
MCU_M16: port MCU_GIOX.M16, port EXT_CON.MCU_M16  [project net EXT_CON.MCU_M16]
MCU_N16: port MCU_GIOX.N16, port EXT_CON.MCU_N16  [project net EXT_CON.MCU_N16]
MCU_P1: port MCU_GIOX.P1, port EXT_CON.MCU_P1  [project net EXT_CON.MCU_P1]
MCU_P2: port MCU_GIOX.P2, port EXT_CON.MCU_P2  [project net EXT_CON.MCU_P2]
MCU_SPI2~{.}CS0: port MCU_SPI2.~{CS0}, port SBC_MCU_SPI.~{CS}
MCU_SPI2~{.}CS1: port MCU_SPI2.~{CS1}, port SBC_PER_SPI.~{CS}
MCU_SPI2~{.}sCS2: port MCU_SPI2.~{sCS2}, port SMSW_SPI.~{CS}
MCU_SPI2.CLK: port MCU_SPI2.CLK, port SBC_MCU_SPI.CLK, port SBC_PER_SPI.CLK, port SMSW_SPI.CLK
MCU_SPI2.SIMO: port MCU_SPI2.SIMO, port SBC_MCU_SPI.MOSI, port SBC_PER_SPI.MOSI, port SMSW_SPI.MOSI
MCU_SPI2.SOMI: port MCU_SPI2.SOMI, port SBC_MCU_SPI.MISO, port SBC_PER_SPI.MISO, port SMSW_SPI.MISO
MCU_SPI3~{.}sCS6: port MCU_SPI3.~{sCS6}, port MRAM_SPI.~{CS}
RTC_CLKO: port MCU_DCC.2, port PER_IO.RTC_CLKO  [project net MCU_DCC.2]
SBC_MCU_FCCU2: port MCU_GIOX.T7, port SUPPLY_IO.SBC_MCU_FCCU2  [project net MCU_GIOX.T7]
SBC_MCU_FS0B: port SUPPLY_IO.SBC_MCU_FS0B, port EXT_CON.SBC_MCU_FS0B  [project net EXT_CON.SBC_MCU_FS0B]
SBC_PER_FCCU2: port MCU_GIOX.T8, port SUPPLY_IO.SBC_PER_FCCU2  [project net MCU_GIOX.T8]
SBC_PER_FS0B: port SUPPLY_IO.SBC_PER_FS0B, port EXT_CON.SBC_PER_FS0B  [project net EXT_CON.SBC_PER_FS0B]
SBC_PER_WAKE2_LL: port MCU_GIOX.N4, port SUPPLY_IO.SBC_PER_WAKE2_LL  [project net MCU_GIOX.N4]
SBCs_FCCU1: port MCU_RST.~{ERROR}, port SUPPLY_IO.SBCs_FCCU1  [project net MCU_RST~{.}ERROR]
SBCs_FIN: port MCU_CLK.2.22MHz, port SUPPLY_IO.SBCs_FIN  [project net MCU_CLK.2.22MHz]
SE_ALERT: harness PE_IO.IO0_1, port PER_IO.SE_ALERT  [project net PE_IO3.IO0_1]
SMSW_LHM: port IODEV_IO.SMSW_LHM, port EXT_CON.SMSW_LHM  [project net EXT_CON.SMSW_LHM]
WW_WDI: port MCU_GIOX.K4, port PER_IO.WW_WDI  [project net MCU_GIOX.K4]

### Buses and harness runs
bus AD1IN[0..31]
bus AD2IN[16..24]
bus SMSW1_IN[1..4]
bus SMSW2_IN[1..4]
harness COM_IO = port COM_IO
harness COM_IO_PE = PE_IO2
harness CONT_FB_IO = PE_IO1
harness EXT_CON = port EXT_CON
harness IF_CON = port IF_CON
harness INTERLOCK_IO = port INTERLOCK_IO
harness IODEV_IO = port IODEV_IO
harness MCU_ADC = port MCU_ADC
harness MCU_CLK = port MCU_CLK
harness MCU_DCC = port MCU_DCC
harness MCU_ECAP = port MCU_ECAP
harness MCU_GIOA = port MCU_GIOA
harness MCU_GIOB = port MCU_GIOB
harness MCU_GIOX = port MCU_GIOX
harness MCU_I2C1 = port MCU_I2C1
harness MCU_RST = port MCU_RST
harness MCU_SPI3 = port MCU_SPI3
harness PER_IO = port PER_IO
harness SUPPLY_IO = port SUPPLY_IO

### Notes on the sheet
- from MCU
- to interface connector
- WAKE1 needed for SBC auto retry
- to ext. board
- to extension connector
- not used
- unused
- Fraunhofer IISB
- Schottkystr. 10
- developed by:
- 91058 Erlangen
- Germany
- Author
- Project
- License
- Description
- File
- Version
- Release Date
- Sheet
- foxbms.org <https://foxbms.org>
- www.iisb.fraunhofer.de <https://www.iisb.fraunhofer.de/>
- foxBMS Team
- /